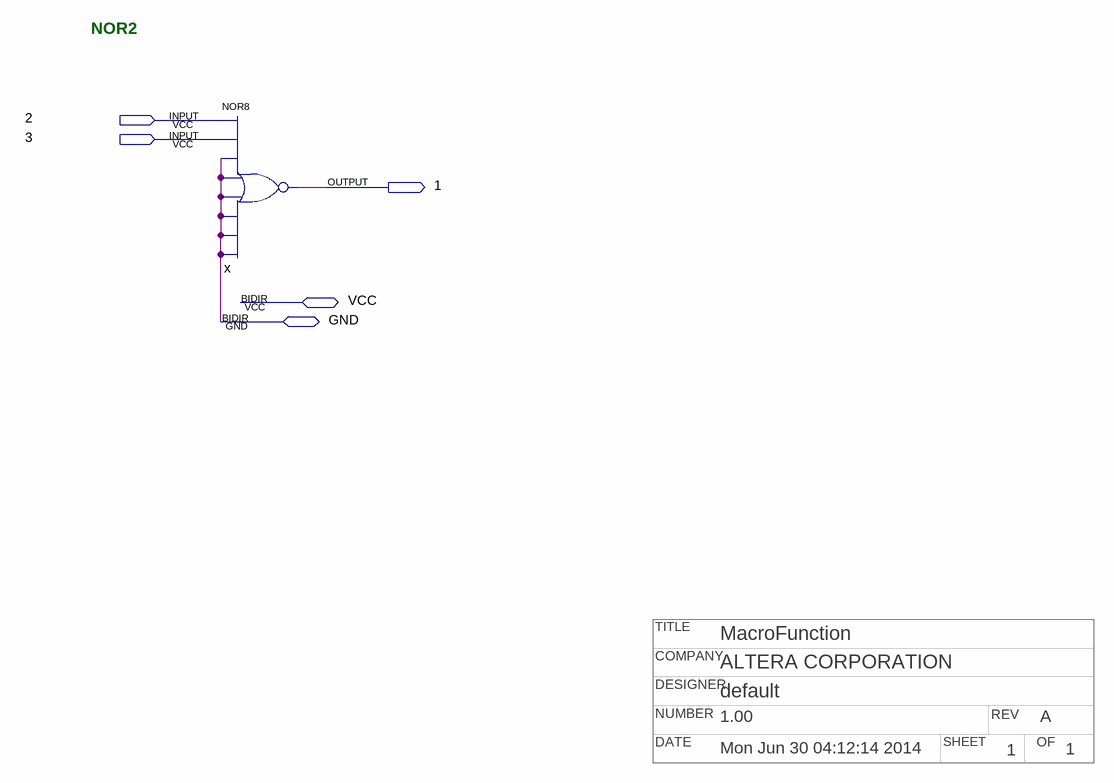
[diagram p0: schematic sheet]
// Quartus schematic npnor2.bdf as structural Verilog: 1 symbols, 5 pins
// Title block: TITLE: MacroFunction; COMPANY: ALTERA CORPORATION; DESIGNER: default; NUMBER: 1.00; REV: A; DATE: Mon Jun 30 04:12:14 2014; SHEET: 1; OF: 1
module npnor2 (
  input  \2 ,
  input  \3 ,
  inout  VCC,
  inout  GND,
  output \1 
);

  nor x (\1 , \2 , \3 , GND, GND, GND, GND, GND, GND);

  // Notes on the sheet:
  //   NOR2
endmodule
